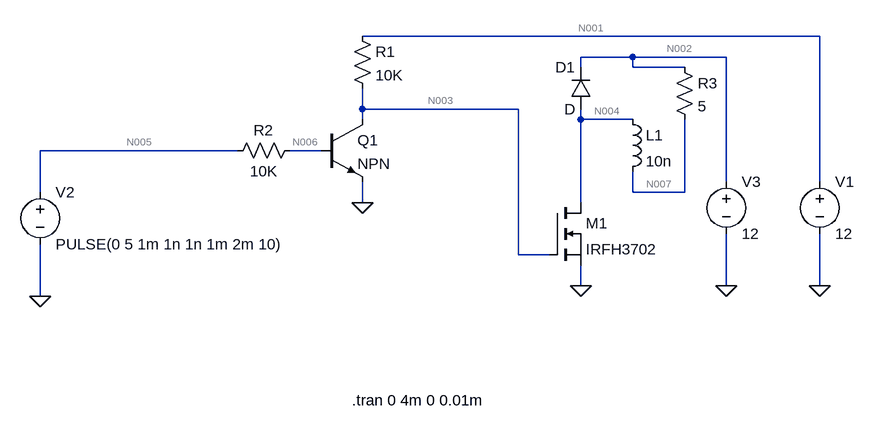
[diagram p0: schematic inverter.asc]
inverter.asc, the LTspice schematic file:
Version 4
SHEET 1 880 680
WIRE 592 -192 -112 -192
WIRE 304 -160 224 -160
WIRE 448 -160 304 -160
WIRE 224 -144 224 -160
WIRE 304 -144 304 -160
WIRE 384 -144 304 -144
WIRE -112 -80 -112 -112
WIRE 128 -80 -112 -80
WIRE -112 -64 -112 -80
WIRE 224 -64 224 -80
WIRE 304 -64 224 -64
WIRE -304 -16 -608 -16
WIRE -176 -16 -224 -16
WIRE 448 32 448 -160
WIRE 592 32 592 -192
WIRE -608 48 -608 -16
WIRE 304 48 304 16
WIRE 384 48 384 -64
WIRE 384 48 304 48
WIRE -112 64 -112 32
WIRE 224 64 224 -64
WIRE 128 144 128 -80
WIRE 176 144 128 144
WIRE 224 192 224 160
WIRE 448 192 448 112
WIRE 592 192 592 112
WIRE -608 208 -608 128
FLAG 224 192 0
FLAG 592 192 0
FLAG -608 208 0
FLAG -112 64 0
FLAG 448 192 0
SYMBOL nmos 176 64 R0
SYMATTR InstName M1
SYMATTR Value IRFH3702
SYMBOL voltage 592 16 R0
WINDOW 123 0 0 Left 2
WINDOW 39 0 0 Left 2
SYMATTR InstName V1
SYMATTR Value 12
SYMBOL voltage -608 32 R0
WINDOW 123 0 0 Left 2
WINDOW 39 0 0 Left 2
SYMATTR InstName V2
SYMATTR Value PULSE(0 5 1m 1n 1n 1m 2m 10)
SYMBOL ind 288 -80 R0
SYMATTR InstName L1
SYMATTR Value 10n
SYMBOL npn -176 -64 R0
SYMATTR InstName Q1
SYMBOL res -128 -208 R0
SYMATTR InstName R1
SYMATTR Value 10K
SYMBOL res -208 -32 R90
WINDOW 0 0 56 VBottom 2
WINDOW 3 32 56 VTop 2
SYMATTR InstName R2
SYMATTR Value 10K
SYMBOL diode 240 -80 R180
WINDOW 0 24 64 Left 2
WINDOW 3 24 0 Left 2
SYMATTR InstName D1
SYMBOL voltage 448 16 R0
WINDOW 123 0 0 Left 2
WINDOW 39 0 0 Left 2
SYMATTR InstName V3
SYMATTR Value 12
SYMBOL res 368 -160 R0
SYMATTR InstName R3
SYMATTR Value 5
TEXT -128 368 Left 2 !.tran 0 4m 0 0.01m

The netlist it stands for:
* inverter.asc
M1 N004 N003 0 0 IRFH3702
V1 N001 0 12
V2 N005 0 PULSE(0 5 1m 1n 1n 1m 2m 10)
L1 N004 N007 10n
Q1 N003 N006 0 0 NPN
R1 N001 N003 10K
R2 N006 N005 10K
D1 N004 N002 D
V3 N002 0 12
R3 N002 N007 5
.model D D
.lib standard.dio
.model NPN NPN
.model PNP PNP
.lib standard.bjt
.model NMOS NMOS
.model PMOS PMOS
.lib standard.mos
.tran 0 4m 0 0.01m
.backanno
.end

* Results of the author's LTspice run, read from the files saved beside the schematic
* Operating Point, zero values left out:
*   V(n004) = 12.52 mV
*   V(n003) = 12 V
*   V(n001) = 12 V
*   V(n007) = 14.92 mV
*   V(n006) = 120 nV
*   V(n002) = 12 V
*   Ic(Q1) = 12 pA
*   Ib(Q1) = -12 pA
*   Id(M1) = 2.397 A
*   Is(M1) = -2.397 A
*   I(D1) = -12 pA
*   I(L1) = -2.397 A
*   I(R3) = 2.397 A
*   I(R2) = 12 pA
*   I(R1) = 12 pA
*   I(V3) = -2.397 A
*   I(V2) = 12 pA
*   I(V1) = -12 pA
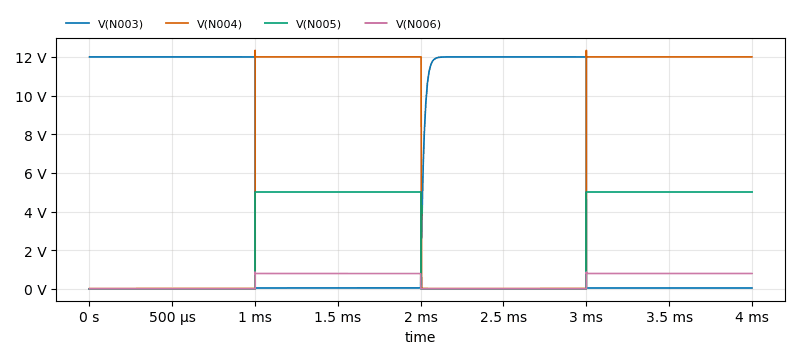
[diagram p1: Transient Analysis of inverter.asc, plotted from the saved traces]
* Transient Analysis, 1 run:
*   V(N003): min 41.54 mV, max 12 V, average 5.965 V, rms 8.425 V, last 41.54 mV
*   V(N004): min 12.5 mV, max 12.34 V, average 6.014 V, rms 8.49 V, last 12 V
*   V(N005): min 0 V, max 5 V, average 2.5 V, rms 3.536 V, last 5 V
*   V(N006): min 0 V, max 870.5 mV, average 396.1 mV, rms 560.2 mV, last 792.1 mV